# EAGLE design PSU (EAGLE 5.10)
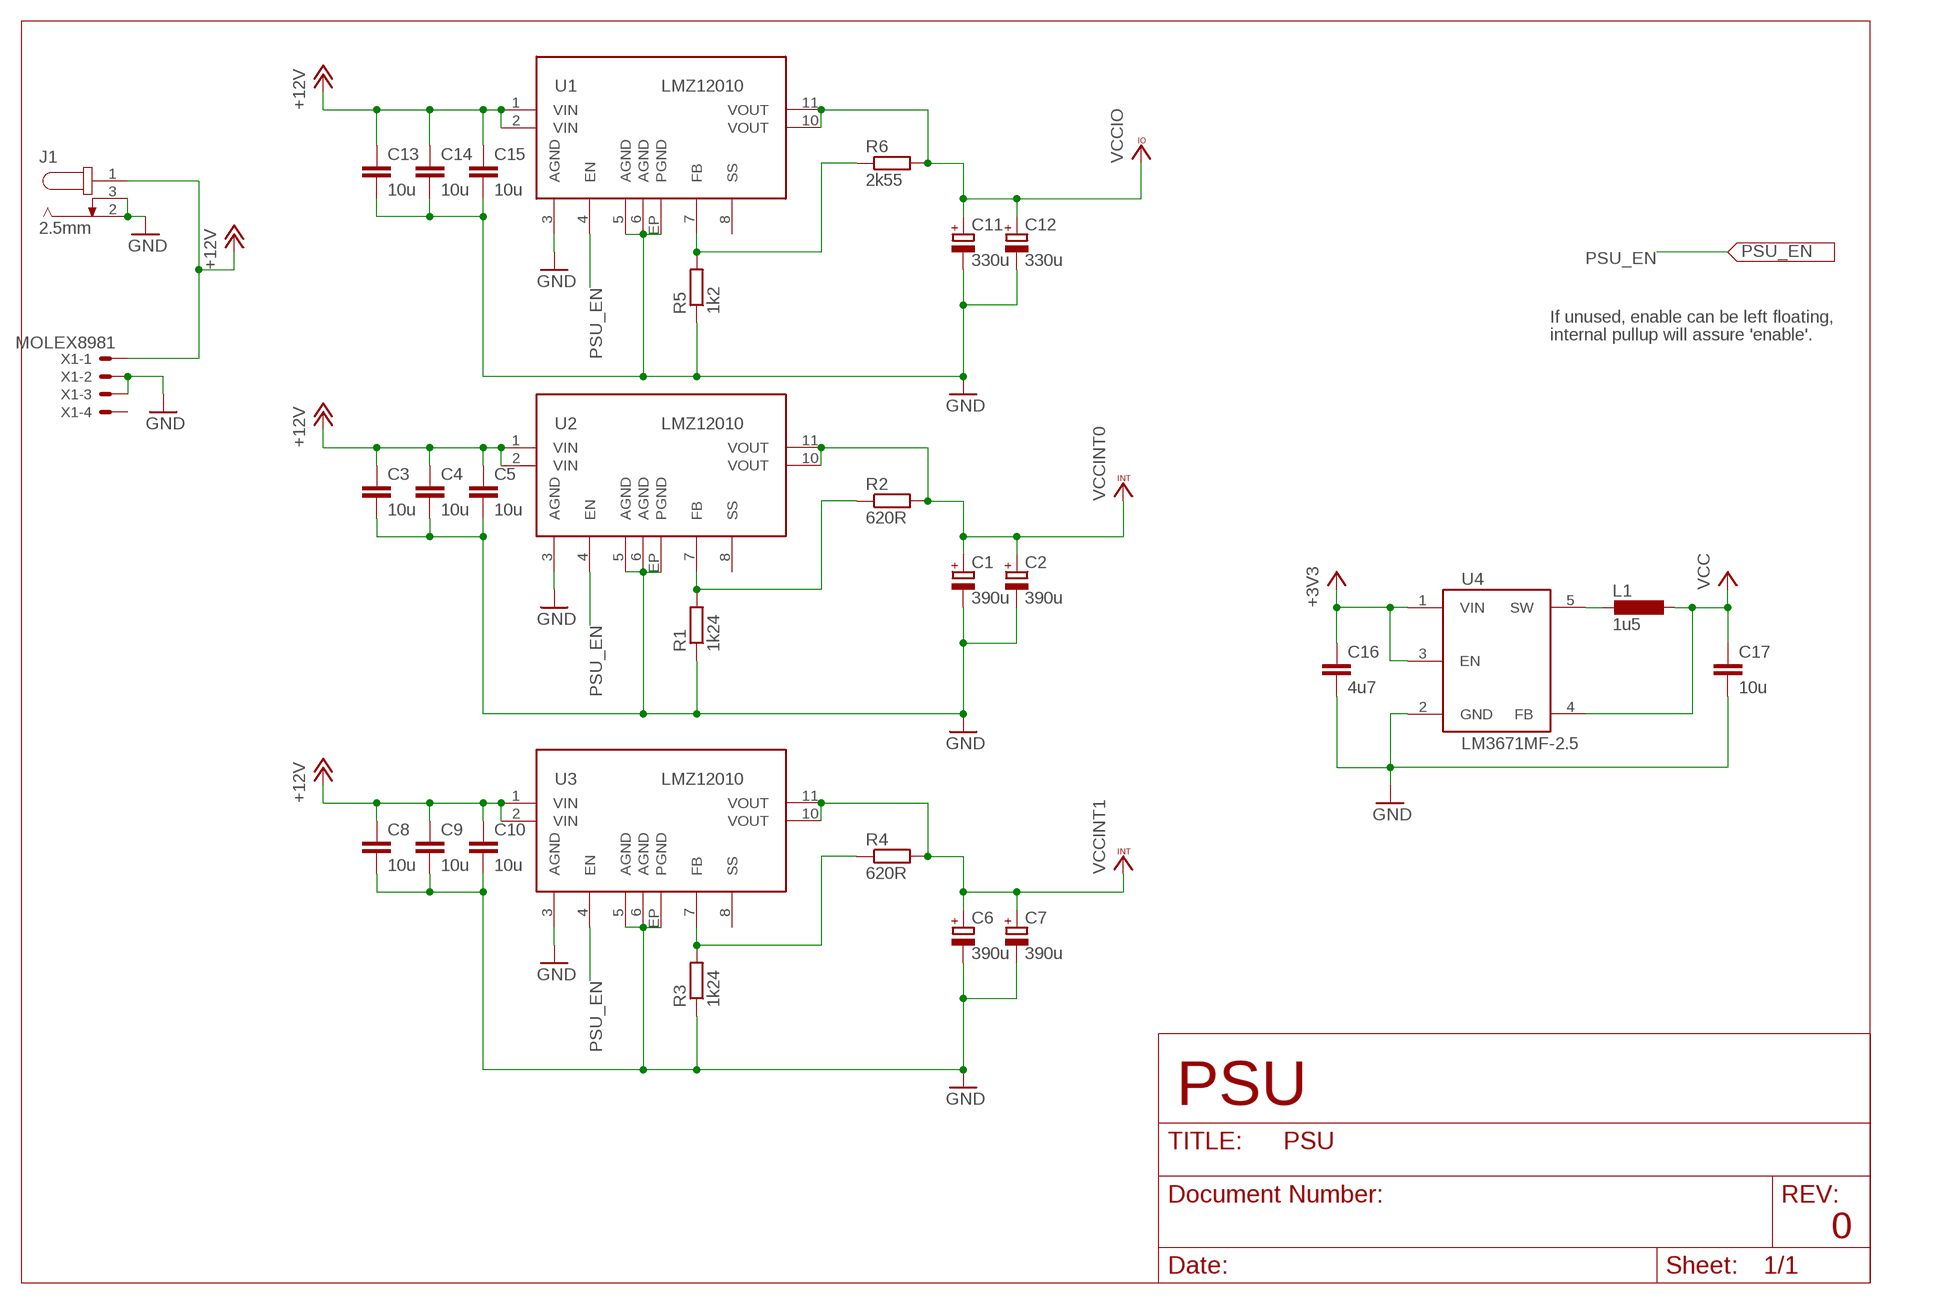
[diagram p0: schematic, sheet 1]

## Parts
C1  390u  CPOL-EUD  [PANASONIC_D]
C2  390u  CPOL-EUD  [PANASONIC_D]
C3  10u  C-EUC2220K  [C2220K]
C4  10u  C-EUC2220K  [C2220K]
C5  10u  C-EUC2220K  [C2220K]
C6  390u  CPOL-EUD  [PANASONIC_D]
C7  390u  CPOL-EUD  [PANASONIC_D]
C8  10u  C-EUC2220K  [C2220K]
C9  10u  C-EUC2220K  [C2220K]
C10  10u  C-EUC2220K  [C2220K]
C11  330u  CPOL-EUD  [PANASONIC_D]
C12  330u  CPOL-EUD  [PANASONIC_D]
C13  10u  C-EUC2220K  [C2220K]
C14  10u  C-EUC2220K  [C2220K]
C15  10u  C-EUC2220K  [C2220K]
C16  4u7  C-EUC3216  [C3216]
C17  10u  C-EUC3216  [C3216]
J1  2.5mm  JACK-PLUG  [PJ036BSMT]
L1  1u5  L-EUL2012C  [L2012C]
R1  1k24  R-EU_R0805  [R0805]
R2  620R  R-EU_R1206  [R1206]
R3  1k24  R-EU_R0805  [R0805]
R4  620R  R-EU_R1206  [R1206]
R5  1k2  R-EU_R0805  [R0805]
R6  2k55  R-EU_R1206  [R1206]
U1  LMZ12010  [TO-PMOD11]
U2  LMZ12010  [TO-PMOD11]
U3  LMZ12010  [TO-PMOD11]
U4  LM3671MF-2.5  [SOT23-5]
X1  MOLEX8981  [0015244455]

## Nets
+3V3: C16.1 U4.1(VIN) U4.3(EN)
+12V: C3.1 C4.1 C5.1 C8.1 C9.1 C10.1 C13.1 C14.1 C15.1 J1.1 U1.1(VIN) U1.2(VIN) U2.1(VIN) U2.2(VIN) U3.1(VIN) U3.2(VIN) X1.1
GND: C1.- C2.- C3.2 C4.2 C5.2 C6.- C7.- C8.2 C9.2 C10.2 C11.- C12.- C13.2 C14.2 C15.2 C16.2 C17.2 J1.2 J1.3 R1.1 R3.1 R5.1 U1.3(AGND) U1.5(AGND) U1.6(AGND) U1.EP(PGND) U2.3(AGND) U2.5(AGND) U2.6(AGND) U2.EP(PGND) U3.3(AGND) U3.5(AGND) U3.6(AGND) U3.EP(PGND) U4.2(GND) X1.2 X1.3
N$5: L1.2 U4.5(SW)
N$7: R1.2 R2.1 U2.7(FB)
N$8: R3.2 R4.1 U3.7(FB)
N$12: R5.2 R6.1 U1.7(FB)
PSU_EN: U1.4(EN) U2.4(EN) U3.4(EN)
VCC: C17.1 L1.1 U4.4(FB)
VCCINT0: C1.+ C2.+ R2.2 U2.10(VOUT) U2.11(VOUT)
VCCINT1: C6.+ C7.+ R4.2 U3.10(VOUT) U3.11(VOUT)
VCCIO: C11.+ C12.+ R6.2 U1.10(VOUT) U1.11(VOUT)
Unconnected: U1.8(SS) U2.8(SS) U3.8(SS) X1.4

## Notes on the sheet
- If unused, enable can be left floating,
- internal pullup will assure 'enable'.
- PSU
- 0

## Library data of the parts
C1 C2 C6 C7 C11 C12 = rcl:CPOL-EU: POLARIZED CAPACITOR, European symbol
C3-C5 C8-C10 C13-C17 = rcl:C-EU: CAPACITOR, European symbol
J1 = FPGAcomp:JACK-PLUG: DC POWER JACK Power Jack, DC, Right Angle, Through Hole, Rated 5A at 16VDC, PC Terminals Manufacturer: CUI Inc Type: PJ-036B-SMT
L1 = rcl:L-EU: INDUCTOR, European symbol
R1-R6 = rcl:R-EU_: RESISTOR, European symbol
U1-U3 = project:LMZ12010: 10A SIMPLE SWITCHER® Power Module with 20V Maximum Input Voltage From the National Semiconductor Simple Switcher Series. Source: http://www.national.com/profile/snip.cgi/openDS=LMZ22010
U4 = project:LM3671?-*: Integrated switcher Source: http://cache.national.com/ds/LM/LM3671.pdf; VOLTAGE: 2.5V
X1 = FPGAcomp:MOLEX8981: Molex 8981 Disk drive power connector, SMD

## Board
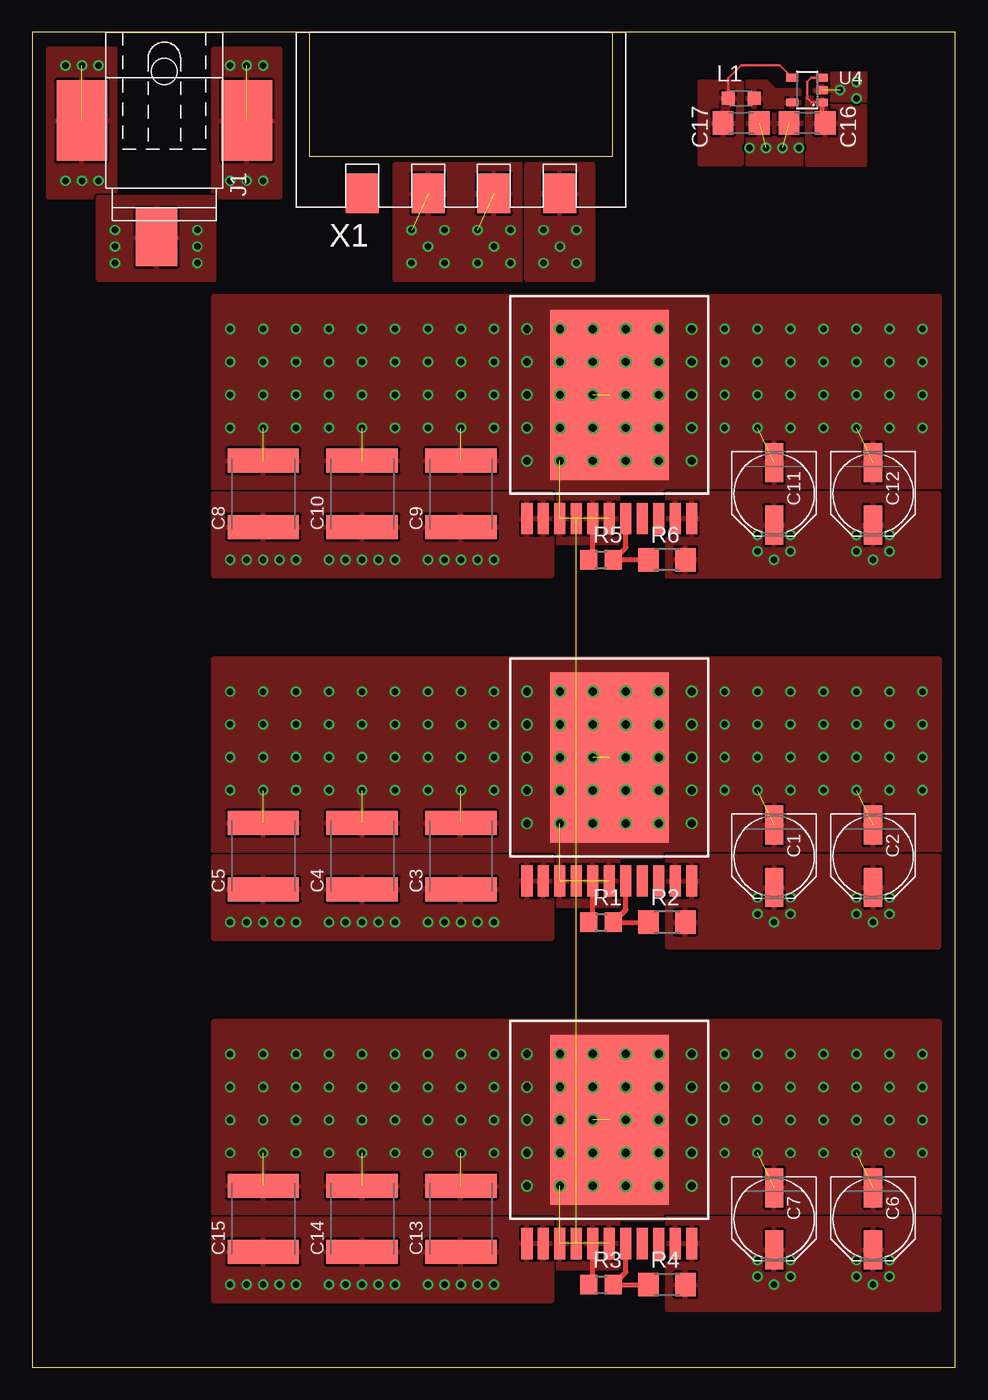
[diagram p1: board, top side]
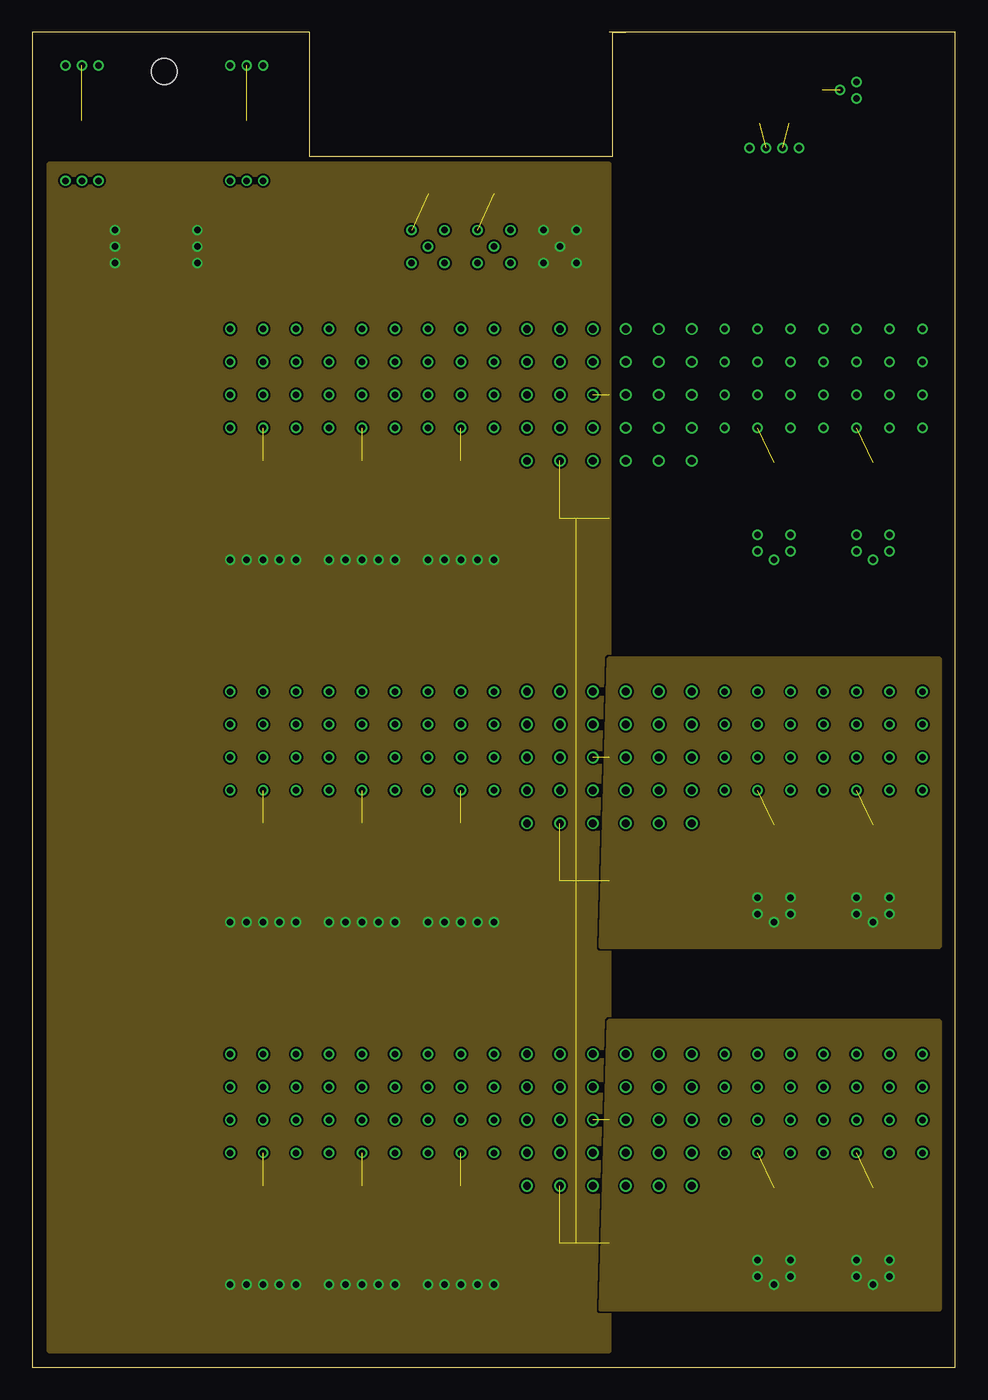
[diagram p2: board, inner layer VCCINT]
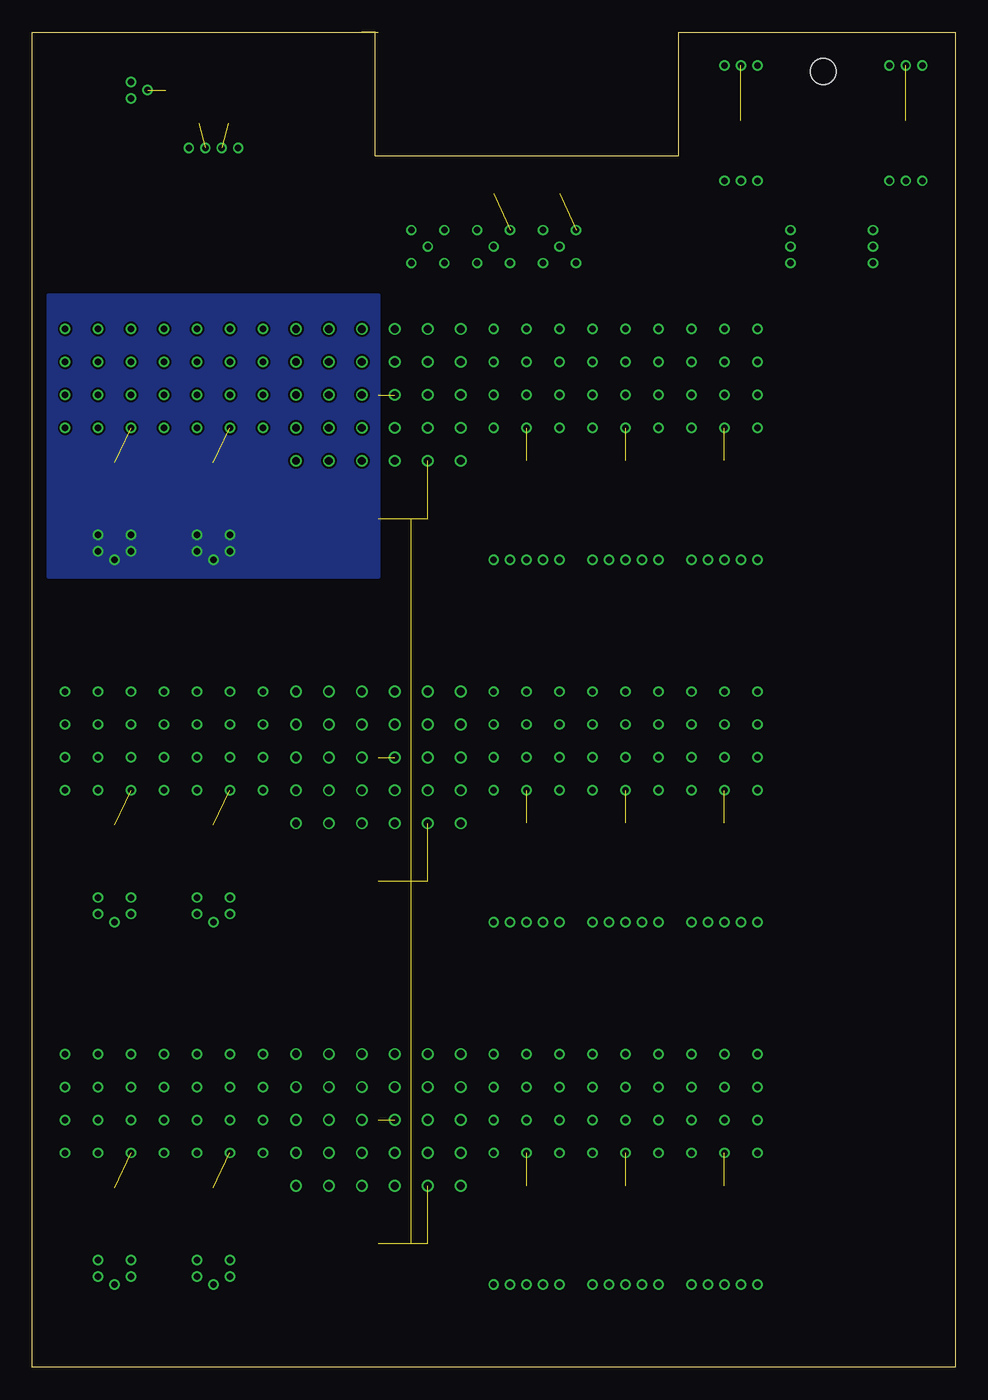
[diagram p3: board, bottom side, seen from below]

Size 71.1 x 102.87 mm. Coordinates in mm from the lower left corner, seen from the top.
Outline: 44.45,102.87 71.1,102.87 71.1,0 0,0 0,102.87 20.32,102.87
Copper layers (1+2*15+16): Top 0.035mm / dielectric 0.1mm / $GND 0.035mm / dielectric 0.86mm / VCCINT 0.035mm / dielectric 0.1mm / Bottom 0.035mm
Design rules "pcbcart": minimum track width 0.15mm, minimum drill 0.3mm, track to track 0.15mm, track to pad 0.15mm, pad to pad 0.15mm, via to via 0.15mm, smd to smd 0.15mm, copper to edge 0.3mm, drill to drill 0.2mm, minimum pad ring 0.2mm, minimum via ring 0.15mm, stop-mask expansion 0.075mm, vias tented up to drill 0mil, thermal gap 0.2mm

### Footprints (pad centres in the part's own frame; a part is rotated, then mirrored left to right if it is on the bottom)
PANASONIC_D = smd 3 x 1.4: + 2.4,0; - -2.4,0
C2220K = smd 1.85 x 5.5: 1 -2.55,0; 2 2.55,0
C3216 = smd 1.6 x 1.8: 1 -1.4,0; 2 1.4,0
PJ036BSMT = smd 4.4 x 3.2: 1 15.8,-0.6 | smd 6.2 x 3.9: 2 6.8,6.35; 3 6.8,-6.35 | hole 2: 3,0
L2012C = smd 1 x 1: 1 -1,0; 2 1,0
R0805 = smd 1.3 x 1.5: 1 -0.95,0; 2 0.95,0
R1206 = smd 1.6 x 1.803: 1 -1.422,0; 2 1.422,0
TO-PMOD11 = smd 0.86 x 2.41: 1 -6.35,-9.525; 2 -5.08,-9.525; 3 -3.81,-9.525; 4 -2.54,-9.525; 5 -1.27,-9.525; 6 0,-9.525; 7 1.27,-9.525; 8 2.54,-9.525; 9 3.81,-9.525; 10 5.08,-9.525; 11 6.35,-9.525 | smd 9.126 x 13.107: EP 0,0
SOT23-5 = smd 0.6 x 0.9: 1 -0.95,-1.15; 2 0,-1.15; 3 0.95,-1.15; 4 0.95,1.15; 5 -0.95,1.15
0015244455 = smd 2.54 x 3.048: 1 7.62,-12.421; 2 2.54,-12.421; 3 -2.54,-12.421; 4 -7.62,-12.421

### Placement (x,y rotation side)
C1  57.15,39.37 270 top
C2  64.77,39.37 270 top
C3  33.02,39.37 90 top
C4  25.4,39.37 90 top
C5  17.78,39.37 90 top
C6  64.77,11.43 270 top
C7  57.15,11.43 270 top
C8  17.78,67.31 90 top
C9  33.02,67.31 90 top
C10  25.4,67.31 90 top
C11  57.15,67.31 270 top
C12  64.77,67.31 270 top
C13  33.02,11.43 90 top
C14  25.4,11.43 90 top
C15  17.78,11.43 90 top
C16  59.69,95.89 180 top
C17  54.61,95.89 0 top
J1  10.16,102.87 270 top
L1  54.61,97.79 0 top
R1  43.81,34.29 0 top
R2  48.9,34.29 0 top
R3  43.81,6.35 0 top
R4  48.9,6.35 0 top
R5  43.81,62.23 0 top
R6  48.9,62.23 0 top
U1  44.45,74.93 0 top
U2  44.45,46.99 0 top
U3  44.45,19.05 0 top
U4  59.69,98.42 90 top
X1  33.02,102.87 0 top

### Tracks (layer width: path | path; a pad name or v marks a point on that pad's centre or on a via)
+3V3
  Top 0.2: U4.3 60.01,99.38 59.69,99.06 59.69,97.79 60.01,97.47 U4.1
  Top 0.4: C16.1 60.84,96.14 U4.1
  pour Top: 59.69,97.79 59.69,92.71 64.14,92.71 64.14,97.16 60.96,97.16 60.96,97.79
+12V  (via drill 0.5)
  other vias: 12.7,87.63 12.7,86.36 12.7,85.09 6.35,85.09 6.35,86.36 6.35,87.63 39.37,87.63 41.91,87.63 41.91,85.09 40.64,86.36 39.37,85.09 15.24,62.23 16.51,62.23 17.78,62.23 19.05,62.23 20.32,62.23 22.86,62.23 24.13,62.23 25.4,62.23 26.67,62.23 27.94,62.23 30.48,62.23 31.75,62.23 33.02,62.23 34.29,62.23 35.56,62.23 15.24,34.29 16.51,34.29 17.78,34.29 19.05,34.29 20.32,34.29 22.86,34.29 24.13,34.29 25.4,34.29 26.67,34.29 27.94,34.29 30.48,34.29 31.75,34.29 33.02,34.29 34.29,34.29 35.56,34.29 15.24,6.35 16.51,6.35 17.78,6.35 19.05,6.35 20.32,6.35 22.86,6.35 24.13,6.35 25.4,6.35 26.67,6.35 27.94,6.35 30.48,6.35 31.75,6.35 33.02,6.35 34.29,6.35 35.56,6.35
  pour Top: 5.08,90.17 13.97,90.17 13.97,83.82 5.08,83.82
  pour Top: 38.1,92.71 43.18,92.71 43.18,83.82 38.1,83.82
  pour VCCINT (rank 2): 44.45,92.71 1.27,92.71 1.27,1.27 44.45,1.27
  pour Top: 13.97,67.31 40.01,67.31 40.01,60.96 13.97,60.96
  pour Top: 13.97,39.37 40.01,39.37 40.01,33.02 13.97,33.02
  pour Top: 13.97,11.43 40.01,11.43 40.01,5.08 13.97,5.08
GND  (via drill 0.5, 0.6)  (34 unrouted)
  Top 0.4: R5.1 43.18,62.23 U1.5 | R1.1 43.18,34.29 U2.5 | R3.1 43.18,6.35 U3.5
  other vias: 36.83,85.09 34.29,85.09 35.56,86.36 36.83,87.63 34.29,87.63 31.75,87.63 31.75,85.09 30.48,86.36 29.21,87.63 29.21,85.09 5.08,91.44 3.81,91.44 2.54,91.44 2.54,100.33 3.81,100.33 5.08,100.33 15.24,100.33 16.51,100.33 17.78,100.33 17.78,91.44 16.51,91.44 15.24,91.44 53.34,80.01 55.88,80.01 58.42,80.01 60.96,80.01 63.5,80.01 66.04,80.01 68.58,80.01 68.58,77.47 66.04,77.47 63.5,77.47 60.96,77.47 58.42,77.47 55.88,77.47 53.34,77.47 53.34,74.93 55.88,74.93 58.42,74.93 60.96,74.93 63.5,74.93 66.04,74.93 68.58,74.93 68.58,72.39 66.04,72.39 63.5,72.39 60.96,72.39 58.42,72.39 55.88,72.39 53.34,72.39 35.56,72.39 35.56,74.93 35.56,77.47 35.56,80.01 33.02,80.01 33.02,77.47 33.02,74.93 33.02,72.39 30.48,72.39 30.48,74.93 30.48,77.47 30.48,80.01 27.94,80.01 27.94,77.47 27.94,74.93 27.94,72.39 25.4,72.39 25.4,74.93 25.4,77.47 25.4,80.01 22.86,80.01 22.86,77.47 22.86,74.93 22.86,72.39 20.32,72.39 20.32,74.93 20.32,77.47 20.32,80.01 17.78,80.01 15.24,80.01 15.24,77.47 15.24,74.93 15.24,72.39 17.78,72.39 17.78,74.93 17.78,77.47 15.24,52.07 17.78,52.07 15.24,49.53 15.24,46.99 15.24,44.45 17.78,44.45 17.78,46.99 17.78,49.53 20.32,52.07 20.32,49.53 20.32,46.99 20.32,44.45 22.86,44.45 22.86,46.99 22.86,49.53 22.86,52.07 25.4,52.07 25.4,49.53 25.4,46.99 25.4,44.45 27.94,44.45 27.94,46.99 27.94,49.53 27.94,52.07 30.48,52.07 30.48,49.53 30.48,46.99 30.48,44.45 33.02,44.45 33.02,46.99 33.02,49.53 33.02,52.07 35.56,52.07 35.56,49.53 35.56,46.99 35.56,44.45 53.34,44.45 53.34,46.99 53.34,49.53 53.34,52.07 55.88,52.07 55.88,49.53 55.88,46.99 55.88,44.45 58.42,44.45 58.42,46.99 58.42,49.53 58.42,52.07 60.96,52.07 60.96,49.53 60.96,46.99 60.96,44.45 63.5,44.45 63.5,46.99 63.5,49.53 63.5,52.07 66.04,52.07 66.04,49.53 66.04,46.99 66.04,44.45 68.58,44.45 68.58,46.99 68.58,49.53 68.58,52.07 15.24,24.13 17.78,24.13 15.24,21.59 15.24,19.05 15.24,16.51 17.78,16.51 17.78,19.05 17.78,21.59 20.32,24.13 20.32,21.59 20.32,19.05 20.32,16.51 22.86,16.51 22.86,19.05 22.86,21.59 22.86,24.13 25.4,24.13 25.4,21.59 25.4,19.05 25.4,16.51 27.94,16.51 27.94,19.05 27.94,21.59 27.94,24.13 30.48,24.13 30.48,21.59 30.48,19.05 30.48,16.51 33.02,16.51 33.02,19.05 33.02,21.59 33.02,24.13 35.56,24.13 35.56,21.59 35.56,19.05 35.56,16.51 53.34,16.51 53.34,19.05 53.34,21.59 53.34,24.13 55.88,24.13 55.88,21.59 55.88,19.05 55.88,16.51 58.42,16.51 58.42,19.05 58.42,21.59 58.42,24.13 60.96,24.13 60.96,21.59 60.96,19.05 60.96,16.51 63.5,16.51 63.5,19.05 63.5,21.59 63.5,24.13 66.04,24.13 66.04,21.59 66.04,19.05 66.04,16.51 68.58,16.51 68.58,19.05 68.58,21.59 68.58,24.13 38.1,80.01 38.1,77.47 38.1,74.93 38.1,72.39 38.1,69.85 50.8,69.85 50.8,72.39 50.8,74.93 50.8,77.47 50.8,80.01 48.26,80.01 48.26,77.47 48.26,74.93 48.26,72.39 48.26,69.85 45.72,69.85 45.72,72.39 45.72,74.93 45.72,77.47 45.72,80.01 43.18,80.01 43.18,77.47 43.18,74.93 43.18,72.39 43.18,69.85 40.64,69.85 40.64,74.93 40.64,77.47 40.64,80.01 50.8,41.91 50.8,44.45 50.8,46.99 50.8,49.53 50.8,52.07 38.1,52.07 38.1,49.53 38.1,46.99 38.1,44.45 38.1,41.91 40.64,41.91 40.64,44.45 40.64,46.99 40.64,49.53 40.64,52.07 43.18,52.07 43.18,49.53 43.18,46.99 43.18,44.45 43.18,41.91 45.72,41.91 45.72,44.45 45.72,46.99 45.72,49.53 45.72,52.07 48.26,52.07 48.26,49.53 48.26,46.99 48.26,44.45 48.26,41.91 38.1,24.13 38.1,21.59 38.1,19.05 38.1,16.51 38.1,13.97 50.8,13.97 50.8,16.51 50.8,19.05 50.8,21.59 50.8,24.13 48.26,24.13 48.26,21.59 48.26,19.05 48.26,16.51 48.26,13.97 45.72,13.97 45.72,16.51 45.72,19.05 45.72,21.59 45.72,24.13 43.18,24.13 43.18,21.59 43.18,19.05 43.18,16.51 43.18,13.97 40.64,13.97 40.64,16.51 40.64,19.05 40.64,21.59 40.64,24.13 63.5,97.79 63.5,99.06 62.23,98.42 55.24,93.98 56.52,93.98 57.78,93.98 59.05,93.98 40.64,72.39
  pour Top (rank 3): 1.27,101.6 6.35,101.6 6.35,90.17 1.27,90.17
  pour Top (rank 3): 13.97,101.6 19.05,101.6 19.05,90.17 13.97,90.17
  pour Top (rank 3): 27.94,92.71 38.1,92.71 38.1,83.82 27.94,83.82
  pour Top (rank 3): 69.85,67.31 45.09,67.31 45.09,63.5 40.01,63.5 40.01,67.31 13.97,67.31 13.97,82.55 69.85,82.55
  pour Top (rank 3, no thermals): 38.1,82.55 50.8,82.55 50.8,67.31 38.1,67.31
  pour Top (rank 3): 13.97,54.61 69.85,54.61 69.85,39.37 45.09,39.37 45.09,35.56 40.01,35.56 40.01,39.37 13.97,39.37
  pour Top (rank 3, no thermals): 38.1,54.61 50.8,54.61 50.8,39.37 38.1,39.37
  pour Top (rank 3): 13.97,26.67 69.85,26.67 69.85,11.43 45.09,11.43 45.09,7.62 40.01,7.62 40.01,11.43 13.97,11.43
  pour Top (rank 3, no thermals): 38.1,26.67 50.8,26.67 50.8,11.43 38.1,11.43
  pour Top (rank 3): 60.33,99.06 61.59,99.06 61.59,99.69 64.14,99.69 64.14,97.16 61.59,97.16 61.59,97.79 60.33,97.79
  pour Top (rank 3): 54.61,96.52 59.69,96.52 59.69,92.71 54.61,92.71
N$5
  pour Top (rank 2): 54.61,99.06 56.52,99.06 57.15,98.42 59.05,98.42 59.05,97.16 54.61,97.16
N$7
  Top 0.4: R2.1 R1.2 45.72,35.24 U2.7
N$8
  Top 0.4: R4.1 R3.2 45.72,7.3 U3.7
N$12
  Top 0.4: R6.1 R5.2 45.72,63.19 U1.7
PSU_EN  (2 unrouted)
VCC
  Top 0.2: U4.4 57.59,100.33 54.61,100.33 53.61,99.33 L1.1
  pour Top: 54.61,99.06 54.61,92.71 51.44,92.71 51.44,99.06
VCCINT0  (via drill 0.5)
  other vias: 58.42,34.92 58.42,36.2 57.15,34.29 55.88,34.92 55.88,36.2 63.5,34.92 63.5,36.2 64.77,34.29 66.04,34.92 66.04,36.2
  pour Top: 69.85,39.37 48.9,39.37 48.9,32.38 69.85,32.38
  pour VCCINT: 44.45,54.61 69.85,54.61 69.85,32.38 43.81,32.38
VCCINT1  (via drill 0.5)
  other vias: 58.42,6.99 58.42,8.26 57.15,6.35 55.88,6.99 55.88,8.26 63.5,6.99 63.5,8.26 64.77,6.35 66.04,6.99 66.04,8.26
  pour VCCINT: 44.45,26.67 69.85,26.67 69.85,4.45 43.81,4.45
  pour Top: 69.85,11.43 48.9,11.43 48.9,4.45 69.85,4.45
VCCIO  (via drill 0.5)
  other vias: 55.88,64.14 55.88,62.87 57.15,62.23 58.42,62.87 58.42,64.14 66.04,64.14 66.04,62.87 64.77,62.23 63.5,62.87 63.5,64.14
  pour Top: 69.85,67.31 48.9,67.31 48.9,60.96 69.85,60.96
  pour Bottom: 44.45,82.55 69.85,82.55 69.85,60.96 44.45,60.96